# EAGLE schematic ESP_FSR_v3 (EAGLE 8.1.1)
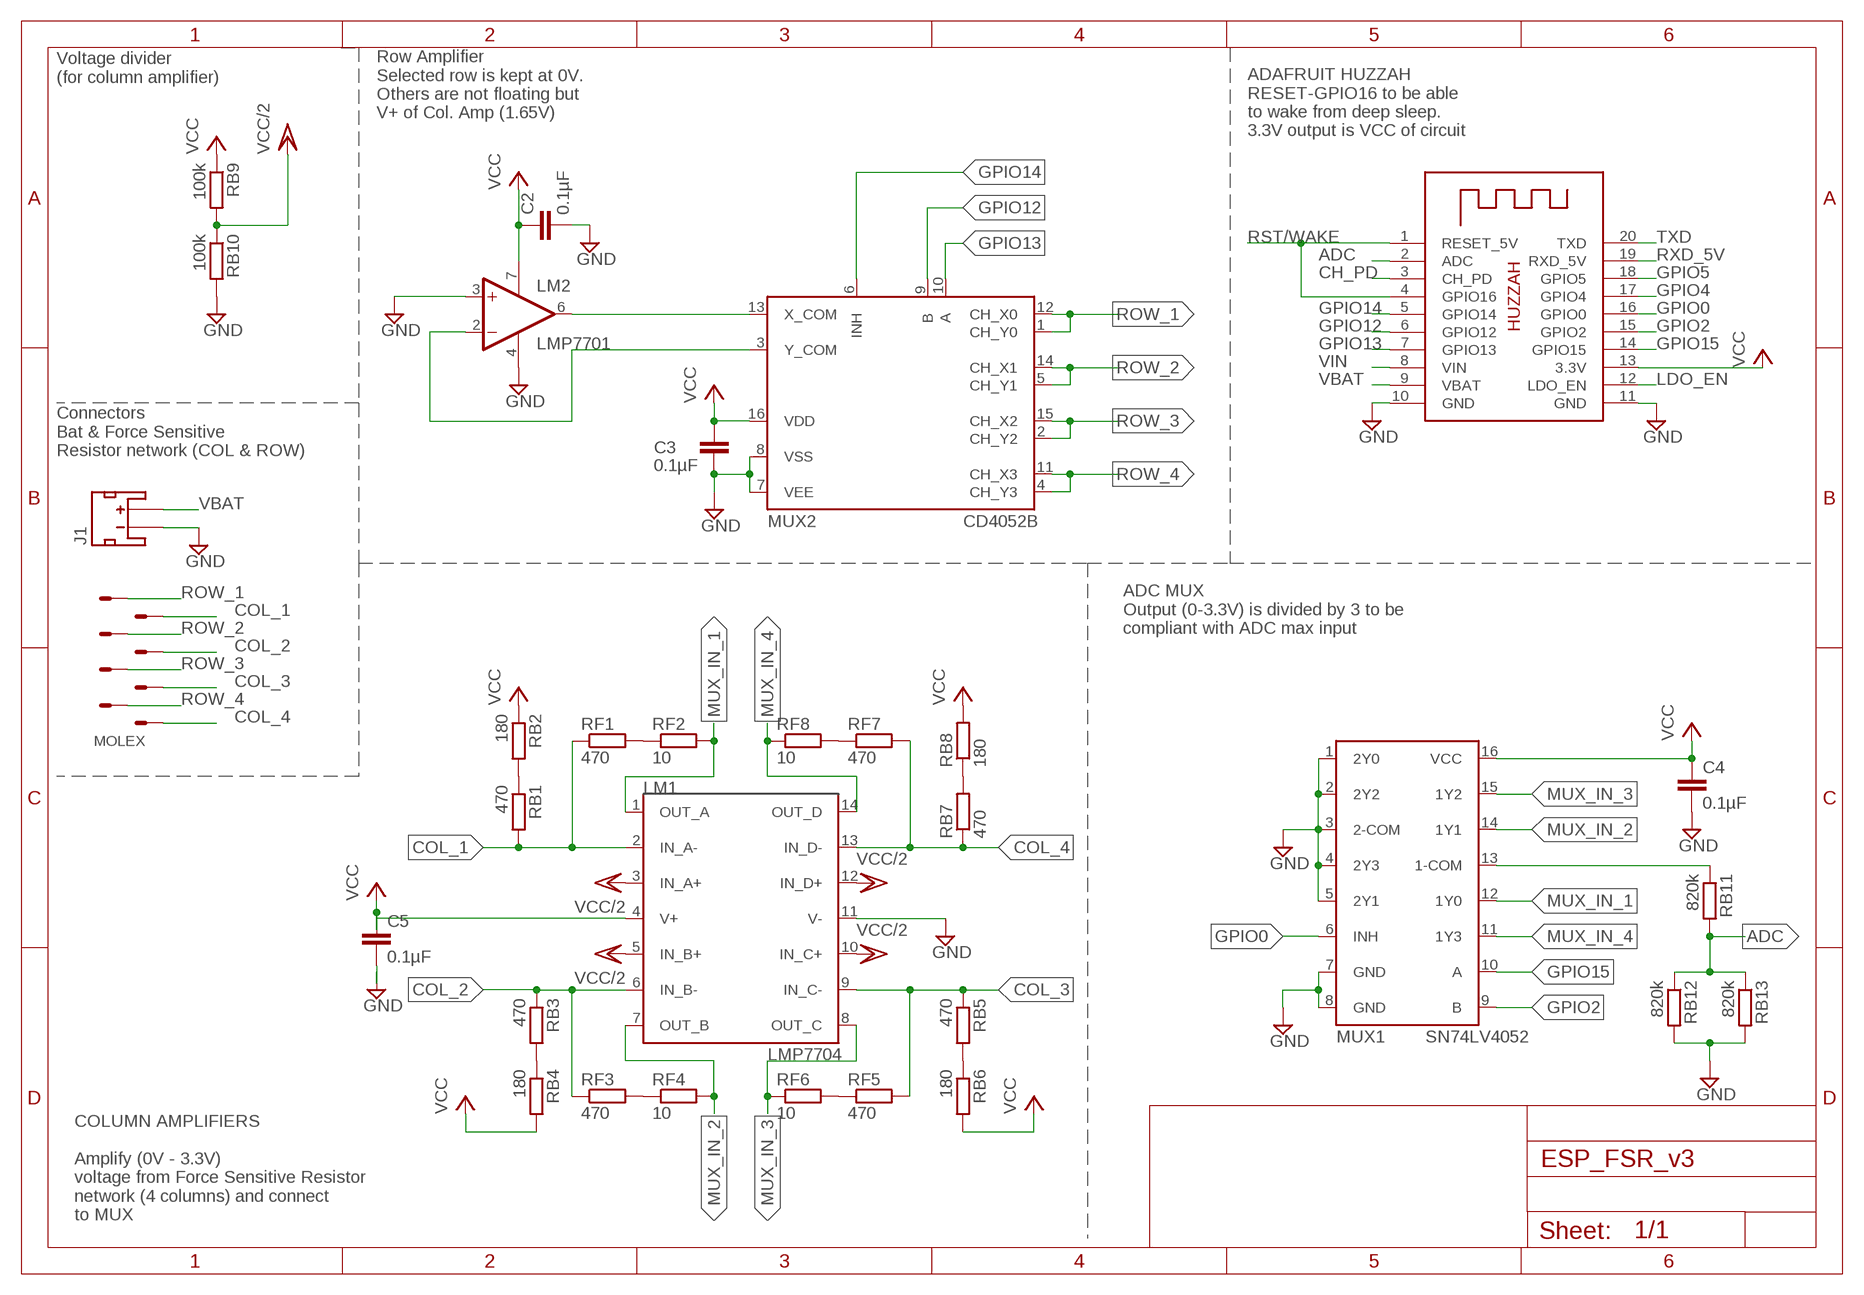
[diagram p0: schematic, sheet 1]

## Parts
C2  0.1µF  C-EUC0805  [C0805]
C3  0.1µF  C-EUC0805  [C0805]
C4  0.1µF  C-EUC0805  [C0805]
C5  0.1µF  C-EUC0805  [C0805]
J1  JST_2MM_MALE  [JST-2-SMD]
LM1  LMP7704  [D_R-PDSO-G14]
LM2  LMP7701  [D_R-PDSO-G08]
MOLEX  90130-3308  [90130-3308]
MUX1  SN74LV4052  [D_R-PDSO-G16]
MUX2  CD4052B  [D_R-PDSO-G16]
RB1  470  R-EU_R0805  [R0805]
RB2  180  R-EU_R0805  [R0805]
RB3  470  R-EU_R0805  [R0805]
RB4  180  R-EU_R0805  [R0805]
RB5  470  R-EU_R0805  [R0805]
RB6  180  R-EU_R0805  [R0805]
RB7  470  R-EU_R0805  [R0805]
RB8  180  R-EU_R0805  [R0805]
RB9  100k  R-EU_R0805  [R0805]
RB10  100k  R-EU_R0805  [R0805]
RB11  820k  R-EU_R0805  [R0805]
RB12  820k  R-EU_R0805  [R0805]
RB13  820k  R-EU_R0805  [R0805]
RF1  470  R-EU_R0805  [R0805]
RF2  10  R-EU_R0805  [R0805]
RF3  470  R-EU_R0805  [R0805]
RF4  10  R-EU_R0805  [R0805]
RF5  470  R-EU_R0805  [R0805]
RF6  10  R-EU_R0805  [R0805]
RF7  470  R-EU_R0805  [R0805]
RF8  10  R-EU_R0805  [R0805]
U$1  HUZZAH  [HUZZAH]

## Nets
ADC: RB11.2 RB12.1 RB13.1 U$1.2(ADC)
CH_PD: U$1.3(CH_PD)
COL_1: LM1.2(IN_A-) MOLEX.P$2 RB1.2 RF1.1
COL_2: LM1.6(IN_B-) MOLEX.P$4 RB3.1 RF3.1
COL_3: LM1.9(IN_C-) MOLEX.P$6 RB5.1 RF5.2
COL_4: LM1.13(IN_D-) MOLEX.P$8 RB7.1 RF7.2
GND: C2.2 C3.2 C4.2 C5.2 J1.1(-) LM1.11(V-) LM2.3(+IN) LM2.4(V-) MUX1.1(2Y0) MUX1.2(2Y2) MUX1.3(2-COM) MUX1.4(2Y3) MUX1.5(2Y1) MUX1.7(GND) MUX1.8(GND) MUX2.7(VEE) MUX2.8(VSS) RB10.2 RB12.2 RB13.2 U$1.10(GND) U$1.11(GND)
GPIO0: MUX1.6(INH) U$1.16(GPIO0)
GPIO2: MUX1.9(B) U$1.15(GPIO2)
GPIO4: U$1.17(GPIO4)
GPIO5: U$1.18(GPIO5)
GPIO12: MUX2.9(B) U$1.6(GPIO12)
GPIO13: MUX2.10(A) U$1.7(GPIO13)
GPIO14: MUX2.6(INH) U$1.5(GPIO14)
GPIO15: MUX1.10(A) U$1.14(GPIO15)
LDO_EN: U$1.12(LDO_EN)
MUX_IN_1: LM1.1(OUT_A) MUX1.12(1Y0) RF2.2
MUX_IN_2: LM1.7(OUT_B) MUX1.14(1Y1) RF4.2
MUX_IN_3: LM1.8(OUT_C) MUX1.15(1Y2) RF6.1
MUX_IN_4: LM1.14(OUT_D) MUX1.11(1Y3) RF8.1
N$1: RB3.2 RB4.1
N$2: RF1.2 RF2.1
N$3: MUX1.13(1-COM) RB11.1
N$4: RF5.1 RF6.2
N$20: LM2.6(OUT) MUX2.13(X_COM)
N$22: LM2.2(-IN) MUX2.3(Y_COM)
N$24: RF7.1 RF8.2
N$25: RB5.2 RB6.1
N$27: RB1.1 RB2.2
N$31: RF3.2 RF4.1
N$32: RB7.2 RB8.1
ROW_1: MOLEX.P$1 MUX2.1(CH_Y0) MUX2.12(CH_X0)
ROW_2: MOLEX.P$3 MUX2.5(CH_Y1) MUX2.14(CH_X1)
ROW_3: MOLEX.P$5 MUX2.2(CH_Y2) MUX2.15(CH_X2)
ROW_4: MOLEX.P$7 MUX2.4(CH_Y3) MUX2.11(CH_X3)
RST/WAKE: U$1.1(RESET_5V) U$1.4(GPIO16)
RXD_5V: U$1.19(RXD_5V)
TXD: U$1.20(TXD)
VBAT: J1.2(+) U$1.9(VBAT)
VCC: C2.1 C3.1 C4.1 C5.1 LM1.4(V+) LM2.7(V+) MUX1.16(VCC) MUX2.16(VDD) RB2.1 RB4.2 RB6.2 RB8.2 RB9.1 U$1.13(3.3V)
VCC/2: LM1.3(IN_A+) LM1.5(IN_B+) LM1.10(IN_C+) LM1.12(IN_D+) RB9.2 RB10.1
VIN: U$1.8(VIN)
Unconnected: J1.NC1(PAD1) J1.NC2(PAD2)

## Notes on the sheet
- Voltage divider
  (for column amplifier)
- Row Amplifier
  Selected row is kept at 0V.
  Others are not floating but
  V+ of Col. Amp (1.65V)
- ADAFRUIT HUZZAH
  RESET-GPIO16 to be able
  to wake from deep sleep.
  3.3V output is VCC of circuit
- Connectors
  Bat & Force Sensitive
  Resistor network (COL & ROW)
- ADC MUX
  Output (0-3.3V) is divided by 3 to be
  compliant with ADC max input
- COLUMN AMPLIFIERS
  
  Amplify (0V - 3.3V)
  voltage from Force Sensitive Resistor
  network (4 columns) and connect
  to MUX

## Library data of the parts
C2-C5 = rcl:C-EU: CAPACITOR, European symbol
J1 = SparkFun-Connectors:JST_2MM_MALE: JST 2MM MALE RA CONNECTOR Two pin, compact surface mount connector. Commonly used as a battery input connection point. We really like the solid locking feeling and high current rating on these small connectors. We use these all the time as battery connectors. Mates to single-cell LiPo batteries. Here is the connector we sell at SparkFun: JST Right Angle Connector - White <https://www.sparkfun.com/products/8612> (PRT-08612) Datasheet <http://www.sparkfun.com/datasheets/Prototyping/Connectors/JST-Horizontal.pdf> It was used on these SparkFun products: SparkFun MOSFET Power Controller <https://www.sparkfun.com/products/11214> (PRT-11214) SparkFun Battery Babysitter - LiPo Battery Manager <https://www.sparkfun.com/products/13777> (PRT-13777) And many, many others that required a lipo battery connection.; PROD_ID: CONN-11443; SF_ID: PRT-08612
LM1 = texas:LMP7704: LMP7704 From http://www.ti.com/lit/ds/symlink/lmp7701.pdf
LM2 = texas:LMP7701
MOLEX = con-molex:90130-3308
MUX1 = texas:SN74LV4052
MUX2 = texas:CD4052B: CD4052B CMOS Differential 4-Channel Analog Multiplexer/Demultiplexer with Logic-Level Conversion From: http://www.ti.com/lit/ds/symlink/cd4052b.pdf
RB1-RB13 RF1-RF8 = rcl:R-EU_: RESISTOR, European symbol
U$1 = adafruit:HUZZAH